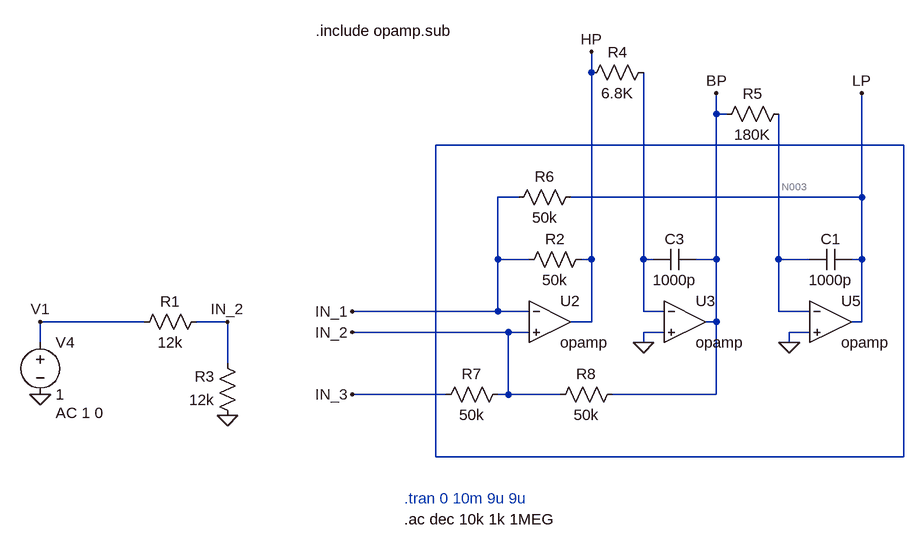
[diagram p0: schematic TPLAB_G2.asc]
TPLAB_G2.asc, the LTspice schematic file:
Version 4.1
SHEET 1 936 680
WIRE 0 -288 0 -320
WIRE 192 -224 192 -256
WIRE 208 -224 192 -224
WIRE 480 -176 -240 -176
WIRE -112 -96 -144 -96
WIRE 416 -96 416 -256
WIRE 416 -96 -32 -96
WIRE -144 0 -144 -96
WIRE -96 0 -144 0
WIRE 0 0 0 -288
WIRE 0 0 -16 0
WIRE 80 0 80 -288
WIRE 96 0 80 0
WIRE 192 0 192 -224
WIRE 192 0 160 0
WIRE 288 0 288 -224
WIRE 336 0 288 0
WIRE 416 0 416 -96
WIRE 416 0 400 0
WIRE -144 80 -144 0
WIRE -144 80 -368 80
WIRE -96 80 -144 80
WIRE 80 80 80 0
WIRE 112 80 80 80
WIRE 288 80 288 0
WIRE 336 80 288 80
WIRE -688 96 -848 96
WIRE -560 96 -608 96
WIRE 0 96 0 0
WIRE 0 96 -32 96
WIRE 192 96 192 0
WIRE 192 96 176 96
WIRE 416 96 416 0
WIRE 416 96 400 96
WIRE -128 112 -368 112
WIRE -96 112 -128 112
WIRE 112 112 80 112
WIRE 336 112 304 112
WIRE -848 128 -848 96
WIRE 80 128 80 112
WIRE 304 128 304 112
WIRE -560 160 -560 96
WIRE -224 208 -368 208
WIRE -128 208 -128 112
WIRE -128 208 -144 208
WIRE -48 208 -128 208
WIRE 192 208 192 96
WIRE 192 208 32 208
WIRE -240 304 -240 -176
WIRE 480 304 480 -176
WIRE 480 304 -240 304
FLAG -848 208 0
FLAG -848 96 V1
FLAG 0 -320 HP
FLAG -368 112 IN_2
FLAG -368 208 IN_3
FLAG -368 80 IN_1
FLAG 80 128 0
FLAG 304 128 0
FLAG 192 -256 BP
FLAG 416 -256 LP
FLAG -560 240 0
FLAG -560 96 IN_2
SYMBOL voltage -848 112 R0
WINDOW 123 24 124 Left 2
WINDOW 39 0 0 Left 0
SYMATTR Value2 AC 1 0
SYMATTR InstName V4
SYMATTR Value 1
SYMBOL OpAmps\\opamp -64 32 R0
SYMATTR InstName U2
SYMBOL OpAmps\\opamp 144 32 R0
SYMATTR InstName U3
SYMBOL OpAmps\\opamp 368 32 R0
SYMATTR InstName U5
SYMBOL res 0 -16 R90
WINDOW 0 0 56 VBottom 2
WINDOW 3 32 56 VTop 2
SYMATTR InstName R2
SYMATTR Value 50k
SYMBOL res -16 -112 R90
WINDOW 0 0 56 VBottom 2
WINDOW 3 32 56 VTop 2
SYMATTR InstName R6
SYMATTR Value 50k
SYMBOL res -128 192 R90
WINDOW 0 0 56 VBottom 2
WINDOW 3 32 56 VTop 2
SYMATTR InstName R7
SYMATTR Value 50k
SYMBOL res 48 192 R90
WINDOW 0 0 56 VBottom 2
WINDOW 3 32 56 VTop 2
SYMATTR InstName R8
SYMATTR Value 50k
SYMBOL cap 336 -16 M90
WINDOW 0 0 32 VBottom 2
WINDOW 3 32 32 VTop 2
SYMATTR InstName C1
SYMATTR Value 1000p
SYMBOL cap 160 -16 R90
WINDOW 0 0 32 VBottom 2
WINDOW 3 32 32 VTop 2
SYMATTR InstName C3
SYMATTR Value 1000p
SYMBOL res -592 80 R90
WINDOW 0 0 56 VBottom 2
WINDOW 3 32 56 VTop 2
SYMATTR InstName R1
SYMATTR Value 12k
SYMBOL res -544 256 R180
WINDOW 0 36 76 Left 2
WINDOW 3 36 40 Left 2
SYMATTR InstName R3
SYMATTR Value 12k
SYMBOL res 96 -304 R90
WINDOW 0 0 56 VBottom 2
WINDOW 3 32 56 VTop 2
SYMATTR InstName R4
SYMATTR Value 6.8K
SYMBOL res 304 -240 R90
WINDOW 0 0 56 VBottom 2
WINDOW 3 32 56 VTop 2
SYMATTR InstName R5
SYMATTR Value 180K
TEXT -288 368 Left 2 ;.tran 0 10m 9u 9u
TEXT -288 400 Left 2 !.ac dec 10k 1k 1MEG
TEXT -424 -352 Left 2 !.include opamp.sub

The netlist it stands for:
* TPLAB_G2.asc
V4 V1 0 1 AC 1 0
X§U2 IN_1 IN_2 HP opamp Aol=100K GBW=10Meg  ; pins invin noninvin out
X§U3 N002 0 BP opamp Aol=100K GBW=10Meg  ; pins invin noninvin out
X§U5 N003 0 LP opamp Aol=100K GBW=10Meg  ; pins invin noninvin out
R2 HP IN_1 50k
R6 LP IN_1 50k
R7 IN_2 IN_3 50k
R8 BP IN_2 50k
C1 N003 LP 1000p
C3 BP N002 1000p
R1 IN_2 V1 12k
R3 0 IN_2 12k
R4 N002 HP 6.8K
R5 N003 BP 180K
* .tran 0 10m 9u 9u
.ac dec 10k 1k 1MEG
.include opamp.sub
.backanno
.end

* Results of the author's LTspice run, read from the files saved beside the schematic
* Operating Point, zero values left out:
*   V(in_1) = 446.4 mV
*   V(n003) = -8.929 µV
*   V(v1) = 1 V
*   V(in_2) = 446.4 mV
*   V(bp) = -8.929 µV
*   V(lp) = 892.9 mV
*   V(in_3) = 446.4 mV
*   I(R2) = -8.929 µA
*   I(R8) = -8.929 µA
*   I(V4) = -46.13 µA
*   I(R6) = 8.929 µA
*   I(R3) = -37.2 µA
*   I(R1) = -46.13 µA
*   Ix(u3:3) = 8.929 µA
*   Ix(u5:3) = -8.929 µA
*   Ix(u2:3) = 8.929 µA